# Altium schematic sheet Simple_LED.SchDoc
size 292 x 193 mm; Author: Power Lin; SheetNumber: 1; SheetTotal: 1; Website: wiki-power.com
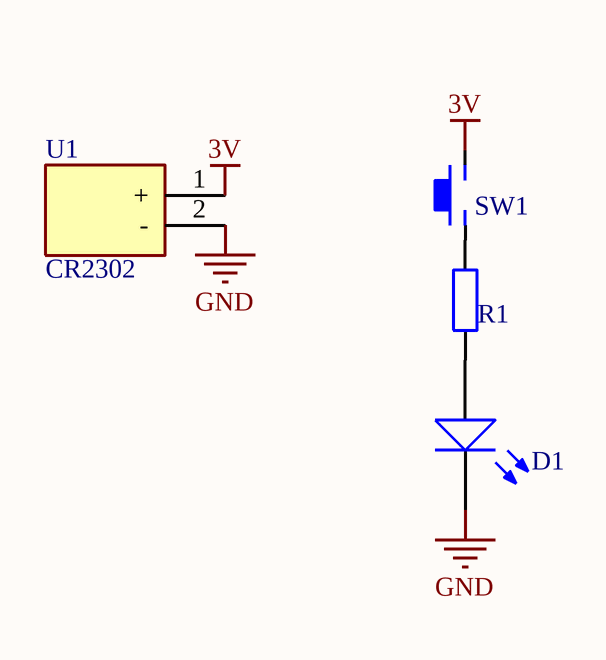
[diagram p0: Simple_LED.SchDoc]

## Parts
D1  RED  [LED-0603]  (value not drawn)
R1  1R  [R-0603]  (value not drawn)
SW1  KEY  [KEY-4P-4.2*3.4*2.5]  (value not drawn)
U1  CR2302  [CR2032-1]

## Nets
3V: SW1.2 U1.1(+)
GND: D1.K U1.2(-)
NetD1_A: D1.A R1.1
NetR1_2: R1.2 SW1.1

## Notes on the sheet
- Author
- DocumentName
- ModifiedDate
- ProjectName
- SheetNumber
- SheetTotal
- Website
- Revision

## Library data of the parts
D1 = LED: 发光二极管; pin to pad: A>1 K>2; ComponentLink1Description: 供应商链接; ComponentLink1URL: http://www.szlcsc.com/product/details_2663.html; Package: 0603; Supplier: LC; SuppliersPartNumber: C2290
R1 = RES: 贴片电阻; Package: 0805; Supplier: LC; SuppliersPartNumber: C17798
SW1 = KEY: 按键开关
U1 = BAT: 锂电池; Manufacturer_Name: Keystone Electronics; Manufacturer_Part_Number: 1026; Allied_Number: 70182086; Datasheet Link: http://www.keyelco.com/product-pdf.cfm?p=721; Mouser Part Number: 534-1026; Mouser Price/Stock: https://www.mouser.com/Search/Refine.aspx?Keyword=534-1026; RS Part Number: 1142133; RS Price/Stock: http://uk.rs-online.com/web/p/products/1142133; Allied Price/Stock: http://www.alliedelec.com/keystone-electronics-1026/70182086/